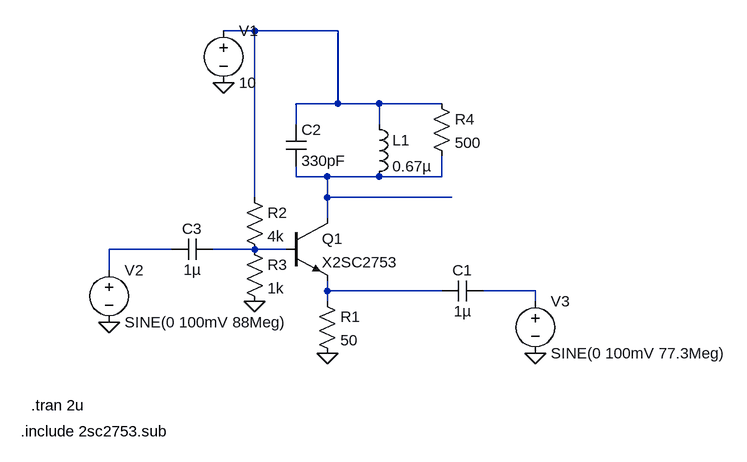
[diagram p0: schematic zackmixer.asc]
zackmixer.asc, the LTspice schematic file:
Version 4
SHEET 1 1396 852
WIRE 144 -64 96 -64
WIRE 272 -64 144 -64
WIRE 272 48 272 -64
WIRE 272 48 208 48
WIRE 336 48 272 48
WIRE 432 48 336 48
WIRE 208 80 208 48
WIRE 336 80 336 48
WIRE 208 160 208 144
WIRE 256 160 208 160
WIRE 336 160 256 160
WIRE 432 160 432 128
WIRE 432 160 336 160
WIRE 144 192 144 -64
WIRE 256 192 256 160
WIRE 448 192 256 192
WIRE 256 224 256 192
WIRE 16 272 -80 272
WIRE 144 272 80 272
WIRE 192 272 144 272
WIRE -80 304 -80 272
WIRE 256 336 256 320
WIRE 432 336 256 336
WIRE 576 336 496 336
WIRE 256 352 256 336
WIRE 576 352 576 336
FLAG 256 432 0
FLAG 96 16 0
FLAG -80 384 0
FLAG 576 432 0
FLAG 144 352 0
SYMBOL npn 192 224 R0
SYMATTR InstName Q1
SYMATTR Value X2SC2753
SYMATTR Prefix X1
SYMBOL Cap 192 80 R0
SYMATTR InstName C2
SYMATTR Value 330pF
SYMBOL ind 320 64 R0
SYMATTR InstName L1
SYMATTR Value 0.67µ
SYMBOL Res 240 336 R0
SYMATTR InstName R1
SYMATTR Value 50
SYMBOL Cap 496 320 R90
WINDOW 0 0 32 VBottom 2
WINDOW 3 32 32 VTop 2
SYMATTR InstName C1
SYMATTR Value 1µ
SYMBOL Cap 80 256 R90
WINDOW 0 0 32 VBottom 2
WINDOW 3 32 32 VTop 2
SYMATTR InstName C3
SYMATTR Value 1µ
SYMBOL voltage 96 -80 R0
SYMATTR InstName V1
SYMATTR Value 10
SYMBOL voltage -80 288 R0
SYMATTR InstName V2
SYMATTR Value SINE(0 100mV 88Meg)
SYMBOL voltage 576 336 R0
SYMATTR InstName V3
SYMATTR Value SINE(0 100mV 77.3Meg)
SYMBOL Res 128 176 R0
SYMATTR InstName R2
SYMATTR Value 4k
SYMBOL Res 128 256 R0
SYMATTR InstName R3
SYMATTR Value 1k
SYMBOL Res 416 32 R0
SYMATTR InstName R4
SYMATTR Value 500
TEXT -200 512 Left 2 !.tran 2u
TEXT -216 552 Left 2 !.include 2sc2753.sub

The netlist it stands for:
* zackmixer.asc
XQ1 N002 N004 N005 X2SC2753  ; pins C B E
C2 N001 N002 330pF
L1 N001 N002 0.67µ
R1 N005 0 50
C1 N006 N005 1µ
C3 N004 N003 1µ
V1 N001 0 10
V2 N003 0 SINE(0 100mV 88Meg)
V3 N006 0 SINE(0 100mV 77.3Meg)
R2 N001 N004 4k
R3 N004 0 1k
R4 N001 N002 500
.tran 2u
.include 2sc2753.sub
.backanno
.end